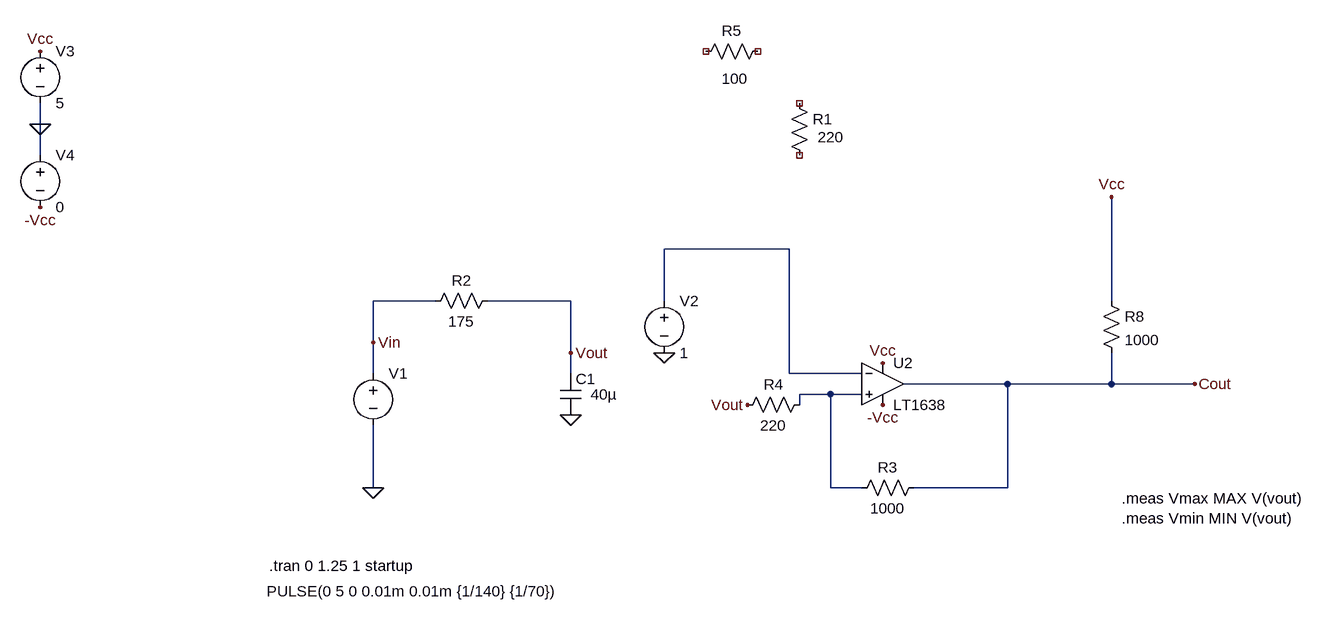
[diagram p0: schematic Integrator_comp_mel.asc]
Integrator_comp_mel.asc, the LTspice schematic file:
Version 4
SHEET 1 1848 680
WIRE -576 -352 -576 -384
WIRE -576 -304 -576 -352
WIRE 576 -160 384 -160
WIRE 32 -80 -64 -80
WIRE 240 -80 112 -80
WIRE 384 -80 384 -160
WIRE 1072 -80 1072 -240
WIRE -64 -16 -64 -80
WIRE 240 0 240 -80
WIRE -64 32 -64 -16
WIRE 240 32 240 0
WIRE 576 32 576 -160
WIRE 688 32 576 32
WIRE 912 48 752 48
WIRE 1072 48 1072 0
WIRE 1072 48 912 48
WIRE 1200 48 1072 48
WIRE 640 64 592 64
WIRE 688 64 640 64
WIRE 592 80 592 64
WIRE -64 208 -64 112
WIRE 640 208 640 64
WIRE 688 208 640 208
WIRE 912 208 912 48
WIRE 912 208 768 208
FLAG -64 208 0
FLAG -64 -16 Vin
FLAG 240 0 Vout
FLAG -576 -352 0
FLAG -576 -464 Vcc
FLAG -576 -224 -Vcc
FLAG 720 16 Vcc
FLAG 720 80 -Vcc
FLAG 512 80 Vout
FLAG 384 0 0
FLAG 240 96 0
FLAG 1200 48 Cout
FLAG 1072 -240 Vcc
SYMBOL voltage -64 16 R0
WINDOW 3 -164 351 Left 2
WINDOW 123 0 0 Left 0
WINDOW 39 0 0 Left 0
SYMATTR Value PULSE(0 5 0 0.01m 0.01m {1/140} {1/70})
SYMATTR InstName V1
SYMBOL cap 224 32 R0
WINDOW 3 47 32 Left 2
SYMATTR Value 40µ
SYMATTR InstName C1
SYMBOL voltage -576 -480 R0
WINDOW 123 0 0 Left 0
WINDOW 39 0 0 Left 0
SYMATTR InstName V3
SYMATTR Value 5
SYMBOL voltage -576 -320 R0
WINDOW 123 0 0 Left 0
WINDOW 39 0 0 Left 0
SYMATTR InstName V4
SYMATTR Value 0
SYMBOL res 784 192 R90
WINDOW 0 0 56 VBottom 2
WINDOW 3 32 56 VTop 2
SYMATTR InstName R3
SYMATTR Value 1000
SYMBOL res 608 64 R90
WINDOW 0 0 56 VBottom 2
WINDOW 3 32 56 VTop 2
SYMATTR InstName R4
SYMATTR Value 220
SYMBOL res 576 -400 R0
WINDOW 3 44 68 Left 2
SYMATTR Value 220
SYMATTR InstName R1
SYMBOL res 544 -480 R90
WINDOW 0 0 56 VBottom 2
WINDOW 3 42 51 VTop 2
SYMATTR InstName R5
SYMATTR Value 100
SYMBOL OpAmps\\LT1638 720 -16 R0
SYMATTR InstName U2
SYMBOL voltage 384 -96 R0
WINDOW 123 0 0 Left 0
WINDOW 39 0 0 Left 0
SYMATTR InstName V2
SYMATTR Value 1
SYMBOL res 128 -96 R90
WINDOW 0 0 56 VBottom 2
WINDOW 3 32 56 VTop 2
SYMATTR InstName R2
SYMATTR Value 175
SYMBOL res 1056 -96 R0
SYMATTR InstName R8
SYMATTR Value 1000
TEXT -224 328 Left 2 !.tran 0 1.25 1 startup
TEXT 1088 224 Left 2 !.meas Vmax MAX V(vout)\n.meas Vmin MIN V(vout)

The netlist it stands for:
* Integrator_comp_mel.asc
V1 Vin 0 PULSE(0 5 0 0.01m 0.01m {1/140} {1/70})
C1 Vout 0 40µ
V3 Vcc 0 5
V4 0 -Vcc 0
R3 Cout N002 1000
R4 N002 Vout 220
R1 NC_01 NC_02 220
R5 NC_03 NC_04 100
XU2 N002 N001 Vcc -Vcc Cout LT1638  ; pins In+ In- V+ V- OUT
V2 N001 0 1
R2 Vout Vin 175
R8 Vcc Cout 1000
.tran 0 1.25 1 startup
.meas Vmax MAX V(vout)
.meas Vmin MIN V(vout)
.backanno
.end